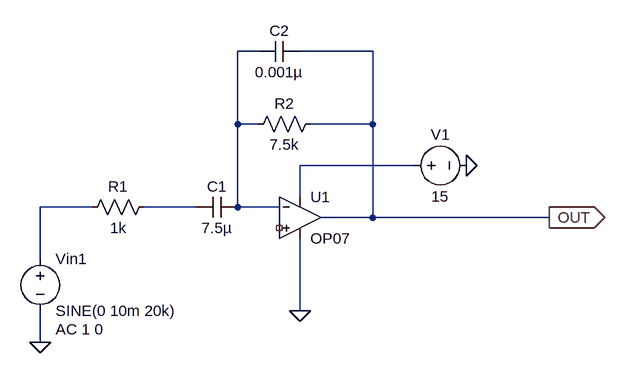
[diagram p0: schematic Draft2.asc]
Draft2.asc, the LTspice schematic file:
Version 4
SHEET 1 880 680
WIRE 208 -96 176 -96
WIRE 384 -96 272 -96
WIRE 176 16 176 -96
WIRE 208 16 176 16
WIRE 384 16 384 -96
WIRE 384 16 288 16
WIRE 448 80 272 80
WIRE 272 128 272 80
WIRE -48 144 -128 144
WIRE 112 144 32 144
WIRE 176 144 176 16
WIRE 240 144 176 144
WIRE 384 160 384 16
WIRE 384 160 304 160
WIRE 656 160 384 160
WIRE -128 224 -128 144
WIRE 272 304 272 192
WIRE -128 352 -128 304
FLAG 272 304 0
FLAG 656 160 OUT
IOPIN 656 160 Out
FLAG -128 352 0
FLAG 528 80 0
SYMBOL voltage -128 208 R0
WINDOW 123 24 124 Left 2
WINDOW 39 0 0 Left 0
SYMATTR Value2 AC 1 0
SYMATTR InstName Vin1
SYMATTR Value SINE(0 10m 20k)
SYMBOL OpAmps\\OP07 272 96 R0
SYMATTR InstName U1
SYMBOL res 48 128 R90
WINDOW 0 0 56 VBottom 2
WINDOW 3 32 56 VTop 2
SYMATTR InstName R1
SYMATTR Value 1k
SYMBOL cap 176 128 R90
WINDOW 0 0 32 VBottom 2
WINDOW 3 32 32 VTop 2
SYMATTR InstName C1
SYMATTR Value 7.5µ
SYMBOL res 304 0 R90
WINDOW 0 0 56 VBottom 2
WINDOW 3 32 56 VTop 2
SYMATTR InstName R2
SYMATTR Value 7.5k
SYMBOL cap 272 -112 R90
WINDOW 0 0 32 VBottom 2
WINDOW 3 32 32 VTop 2
SYMATTR InstName C2
SYMATTR Value 0.001µ
SYMBOL voltage 432 80 R270
WINDOW 0 32 56 VTop 2
WINDOW 3 -32 56 VBottom 2
WINDOW 123 0 0 Left 0
WINDOW 39 0 0 Left 0
SYMATTR InstName V1
SYMATTR Value 15

The netlist it stands for:
* Draft2.asc
Vin1 N003 0 SINE(0 10m 20k) AC 1 0
XU1 NC_01 N001 N002 0 OUT LT1001  ; OP07, pins In+ In- V+ V- OUT
R1 N004 N003 1k
C1 N001 N004 7.5µ
R2 OUT N001 7.5k
C2 OUT N001 0.001µ
V1 N002 0 15
.lib LTC.lib
.backanno
.end